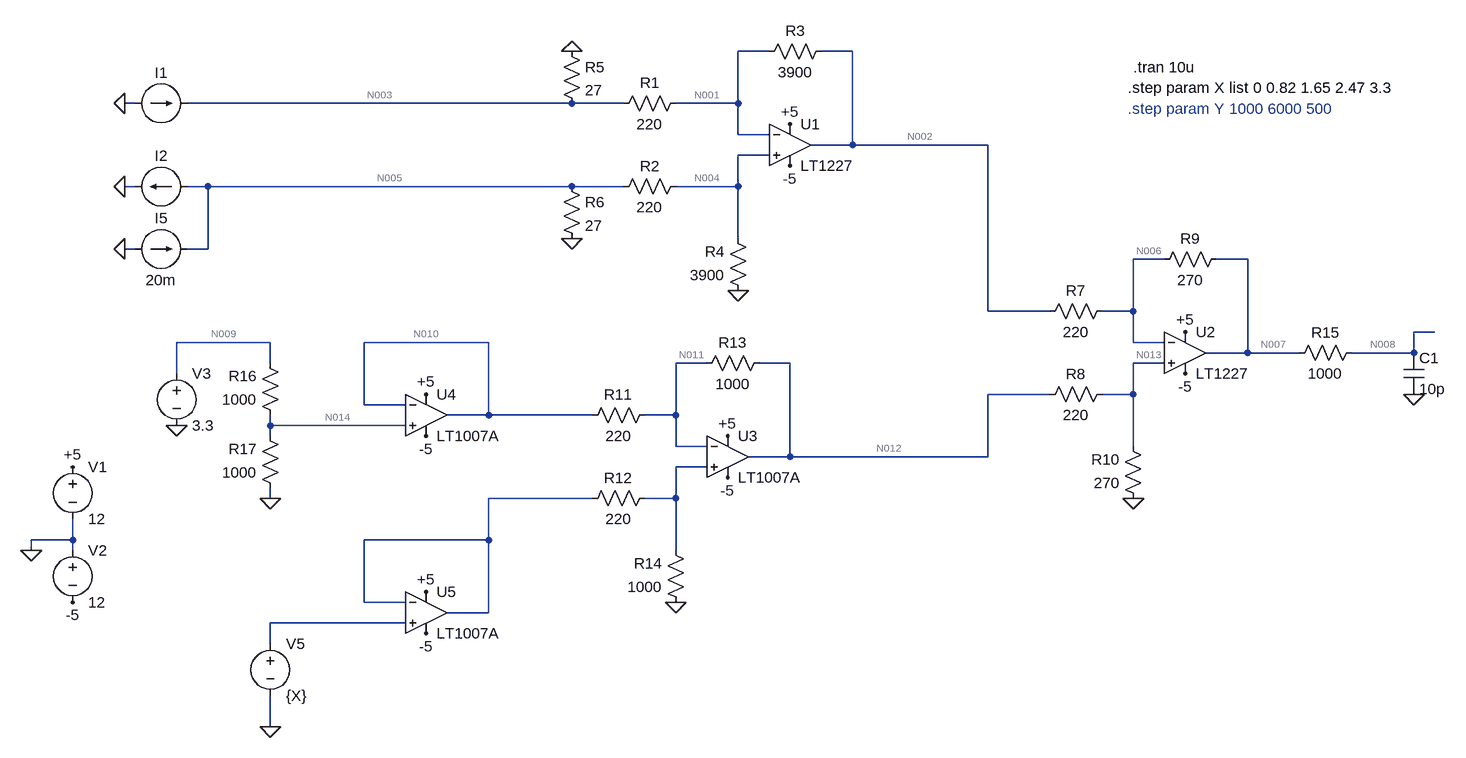
[diagram p0: schematic DAC_output.asc]
DAC_output.asc, the LTspice schematic file:
Version 4
SHEET 1 2484 1984
WIRE 560 112 512 112
WIRE 688 112 640 112
WIRE -416 192 -432 192
WIRE 256 192 -336 192
WIRE 336 192 256 192
WIRE 512 192 512 112
WIRE 512 192 416 192
WIRE 512 240 512 192
WIRE 560 240 512 240
WIRE 688 256 688 112
WIRE 688 256 624 256
WIRE 896 256 688 256
WIRE 560 272 512 272
WIRE -416 320 -432 320
WIRE -304 320 -336 320
WIRE 256 320 -304 320
WIRE 336 320 256 320
WIRE 512 320 512 272
WIRE 512 320 416 320
WIRE 512 400 512 320
WIRE -416 416 -432 416
WIRE -304 416 -304 320
WIRE -304 416 -336 416
WIRE 1168 432 1120 432
WIRE 1296 432 1248 432
WIRE 896 512 896 256
WIRE 992 512 896 512
WIRE 1120 512 1120 432
WIRE 1120 512 1072 512
WIRE 1584 544 1552 544
WIRE -208 560 -352 560
WIRE 128 560 -64 560
WIRE 1120 560 1120 512
WIRE 1168 560 1120 560
WIRE 1296 576 1296 432
WIRE 1296 576 1232 576
WIRE 1376 576 1296 576
WIRE 1552 576 1552 544
WIRE 1552 576 1456 576
WIRE -208 592 -208 560
WIRE 464 592 416 592
WIRE 592 592 544 592
WIRE 1168 592 1120 592
WIRE -352 608 -352 560
WIRE 992 640 896 640
WIRE 1120 640 1120 592
WIRE 1120 640 1072 640
WIRE -64 656 -64 560
WIRE 0 656 -64 656
WIRE 128 672 128 560
WIRE 128 672 64 672
WIRE 288 672 128 672
WIRE 416 672 416 592
WIRE 416 672 368 672
WIRE -208 688 -208 672
WIRE 0 688 -208 688
WIRE -208 704 -208 688
WIRE 416 720 416 672
WIRE 464 720 416 720
WIRE 1120 720 1120 640
WIRE 592 736 592 592
WIRE 592 736 528 736
WIRE 896 736 896 640
WIRE 896 736 592 736
WIRE 464 752 416 752
WIRE -208 800 -208 784
WIRE 288 800 128 800
WIRE 416 800 416 752
WIRE 416 800 368 800
WIRE -512 864 -512 832
WIRE -512 864 -576 864
WIRE 128 864 128 800
WIRE 128 864 -64 864
WIRE -576 880 -576 864
WIRE -512 880 -512 864
WIRE 416 880 416 800
WIRE -64 960 -64 864
WIRE 0 960 -64 960
WIRE 128 976 128 864
WIRE 128 976 64 976
WIRE 0 992 -208 992
WIRE -208 1024 -208 992
WIRE -208 1152 -208 1104
FLAG 512 480 0
FLAG -576 880 0
FLAG -512 752 +5
FLAG 592 224 +5
FLAG -512 960 -5
FLAG 592 288 -5
FLAG 256 112 0
FLAG 256 400 0
FLAG -432 192 0
FLAG -432 416 0
FLAG -432 320 0
FLAG 1120 800 0
FLAG 1200 544 +5
FLAG 1200 608 -5
FLAG 416 960 0
FLAG 496 704 +5
FLAG 496 768 -5
FLAG -208 1152 0
FLAG 1552 640 0
FLAG -208 800 0
FLAG -352 688 0
FLAG 32 704 -5
FLAG 32 640 +5
FLAG 32 1008 -5
FLAG 32 944 +5
SYMBOL res 432 176 R90
WINDOW 0 0 56 VBottom 2
WINDOW 3 32 56 VTop 2
SYMATTR InstName R1
SYMATTR Value 220
SYMBOL res 432 304 R90
WINDOW 0 0 56 VBottom 2
WINDOW 3 32 56 VTop 2
SYMATTR InstName R2
SYMATTR Value 220
SYMBOL res 656 96 R90
WINDOW 0 0 56 VBottom 2
WINDOW 3 32 56 VTop 2
SYMATTR InstName R3
SYMATTR Value 3900
SYMBOL res 528 496 R180
WINDOW 0 36 76 Left 2
WINDOW 3 36 40 Left 2
SYMATTR InstName R4
SYMATTR Value 3900
SYMBOL voltage -512 736 R0
WINDOW 123 0 0 Left 0
WINDOW 39 0 0 Left 0
SYMATTR InstName V1
SYMATTR Value 12
SYMBOL voltage -512 864 R0
WINDOW 123 0 0 Left 0
WINDOW 39 0 0 Left 0
SYMATTR InstName V2
SYMATTR Value 12
SYMBOL res 240 96 R0
SYMATTR InstName R5
SYMATTR Value 27
SYMBOL res 240 304 R0
SYMATTR InstName R6
SYMATTR Value 27
SYMBOL current -416 416 R270
WINDOW 0 32 40 VTop 2
WINDOW 3 -32 40 VBottom 2
WINDOW 123 0 0 Left 0
WINDOW 39 0 0 Left 0
SYMATTR InstName I5
SYMATTR Value 20m
SYMBOL res 1088 496 R90
WINDOW 0 0 56 VBottom 2
WINDOW 3 32 56 VTop 2
SYMATTR InstName R7
SYMATTR Value 220
SYMBOL res 1088 624 R90
WINDOW 0 0 56 VBottom 2
WINDOW 3 32 56 VTop 2
SYMATTR InstName R8
SYMATTR Value 220
SYMBOL res 1264 416 R90
WINDOW 0 0 56 VBottom 2
WINDOW 3 32 56 VTop 2
SYMATTR InstName R9
SYMATTR Value 270
SYMBOL res 1136 816 R180
WINDOW 0 36 76 Left 2
WINDOW 3 36 40 Left 2
SYMATTR InstName R10
SYMATTR Value 270
SYMBOL voltage -208 1008 R0
WINDOW 123 0 0 Left 0
WINDOW 39 0 0 Left 0
SYMATTR InstName V5
SYMATTR Value {X}
SYMBOL OpAmps\\LT1007A 496 672 R0
SYMATTR InstName U3
SYMBOL res 384 656 R90
WINDOW 0 0 56 VBottom 2
WINDOW 3 32 56 VTop 2
SYMATTR InstName R11
SYMATTR Value 220
SYMBOL res 384 784 R90
WINDOW 0 0 56 VBottom 2
WINDOW 3 32 56 VTop 2
SYMATTR InstName R12
SYMATTR Value 220
SYMBOL res 560 576 R90
WINDOW 0 0 56 VBottom 2
WINDOW 3 32 56 VTop 2
SYMATTR InstName R13
SYMATTR Value 1000
SYMBOL res 432 976 R180
WINDOW 0 36 76 Left 2
WINDOW 3 36 40 Left 2
SYMATTR InstName R14
SYMATTR Value 1000
SYMBOL current -416 192 R270
WINDOW 0 32 40 VTop 2
WINDOW 3 4 40 Invisible 2
SYMATTR InstName I1
SYMATTR Value PWL repeat forever(PWL file="D:\kostas\Electronics\Function Generator Round 2\DAC\WAVEFORMS_TEXT\20pointOUT.txt")endrepeat
SYMBOL current -336 320 R90
WINDOW 0 -32 40 VBottom 2
WINDOW 3 -4 40 Invisible 2
SYMATTR InstName I2
SYMATTR Value PWL repeat forever(PWL file="D:\kostas\Electronics\Function Generator Round 2\DAC\WAVEFORMS_TEXT\20pointOUT.txt")endrepeat
SYMBOL cap 1536 576 R0
SYMATTR InstName C1
SYMATTR Value 10p
SYMBOL res 1472 560 R90
WINDOW 0 0 56 VBottom 2
WINDOW 3 32 56 VTop 2
SYMATTR InstName R15
SYMATTR Value 1000
SYMBOL OpAmps\\LT1227 592 192 R0
SYMATTR InstName U1
SYMBOL OpAmps\\LT1227 1200 512 R0
SYMATTR InstName U2
SYMBOL res -192 688 R180
WINDOW 0 36 76 Left 2
WINDOW 3 36 40 Left 2
SYMATTR InstName R16
SYMATTR Value 1000
SYMBOL res -192 800 R180
WINDOW 0 36 76 Left 2
WINDOW 3 36 40 Left 2
SYMATTR InstName R17
SYMATTR Value 1000
SYMBOL voltage -352 592 R0
WINDOW 123 0 0 Left 0
WINDOW 39 0 0 Left 0
SYMATTR InstName V3
SYMATTR Value 3.3
SYMBOL OpAmps\\LT1007A 32 608 R0
SYMATTR InstName U4
SYMBOL OpAmps\\LT1007A 32 912 R0
SYMATTR InstName U5
TEXT 1120 136 Left 2 !.tran 10u
TEXT 1112 168 Left 2 !.step param X list 0 0.82 1.65 2.47 3.3
TEXT 1112 200 Left 2 ;.step param Y 1000 6000 500

The netlist it stands for:
* DAC_output.asc
R1 N001 N003 220
R2 N004 N005 220
R3 N002 N001 3900
R4 0 N004 3900
V1 +5 0 12
V2 0 -5 12
R5 0 N003 27
R6 N005 0 27
I5 0 N005 20m
R7 N006 N002 220
R8 N013 N012 220
R9 N007 N006 270
R10 0 N013 270
V5 N017 0 {X}
XU3 N015 N011 +5 -5 N012 LT1007A  ; pins In+ In- V+ V- OUT
R11 N011 N010 220
R12 N015 N016 220
R13 N012 N011 1000
R14 0 N015 1000
I1 0 N003 PWL repeat forever(PWL file="D:\kostas\Electronics\Function Generator Round 2\DAC\WAVEFORMS_TEXT\20pointOUT.txt")endrepeat
I2 N005 0 PWL repeat forever(PWL file="D:\kostas\Electronics\Function Generator Round 2\DAC\WAVEFORMS_TEXT\20pointOUT.txt")endrepeat
C1 N008 0 10p
R15 N008 N007 1000
XU1 N004 N001 +5 -5 N002 LT1227  ; pins In+ In- V+ V- OUT
XU2 N013 N006 +5 -5 N007 LT1227  ; pins In+ In- V+ V- OUT
R16 N014 N009 1000
R17 0 N014 1000
V3 N009 0 3.3
XU4 N014 N010 +5 -5 N010 LT1007A  ; pins In+ In- V+ V- OUT
XU5 N017 N016 +5 -5 N016 LT1007A  ; pins In+ In- V+ V- OUT
.tran 10u
.step param X list 0 0.82 1.65 2.47 3.3
* .step param Y 1000 6000 500
.backanno
.end

* Results of the author's LTspice run, read from the files saved beside the schematic
* Operating Point (first step), zero values left out:
*   V(n001) = 499.3 mV
*   V(n003) = 54.58 mV
*   V(n004) = 507.8 mV
*   V(n005) = 536.5 mV
*   V(n002) = 7.377 V
*   V(+5) = 12 V
*   V(-5) = -12 V
*   V(n006) = -2.98 V
*   V(n013) = -4.131 V
*   V(n012) = -7.5 V
*   V(n007) = -10.69 V
*   V(n011) = 356.2 nV
*   V(n010) = 1.65 V
*   V(n008) = -10.69 V
*   V(n014) = 1.65 V
*   V(n009) = 3.3 V
*   I(I5) = 20 mA
*   I(R17) = -1.65 mA
*   I(R16) = -1.65 mA
*   I(R13) = -7.5 mA
*   I(R11) = -7.5 mA
*   I(R10) = 15.3 mA
*   I(R9) = -28.55 mA
*   I(R8) = 15.31 mA
*   I(R7) = -47.08 mA
*   I(R6) = 19.87 mA
*   I(R5) = -2.022 mA
*   I(R4) = -130.2 µA
*   I(R3) = 1.764 mA
*   I(R2) = -130.4 µA
*   I(R1) = 2.022 mA
*   I(V3) = -1.65 mA
*   I(V2) = -88.78 mA
*   I(V1) = -75.47 mA